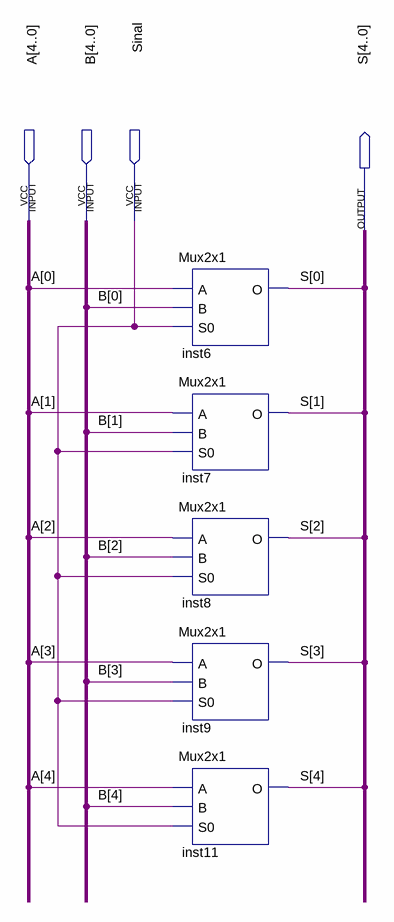
[diagram p0: schematic sheet]
// Quartus schematic Mux2x1_6Bits.bdf as structural Verilog: 5 symbols, 4 pins
module Mux2x1_6Bits (
  input  [4:0] A,
  input  [4:0] B,
  input  Sinal,
  output [4:0] S
);

  Mux2x1 inst6 (.A(A[0]), .B(B[0]), .S0(Sinal), .O(S[0]));
  Mux2x1 inst7 (.A(A[1]), .B(B[1]), .S0(Sinal), .O(S[1]));
  Mux2x1 inst8 (.A(A[2]), .B(B[2]), .S0(Sinal), .O(S[2]));
  Mux2x1 inst9 (.A(A[3]), .B(B[3]), .S0(Sinal), .O(S[3]));
  Mux2x1 inst11 (.A(A[4]), .B(B[4]), .S0(Sinal), .O(S[4]));
endmodule
